# EAGLE design LED-Lampe Power  ZXLD1374 (EAGLE 6.5.0)
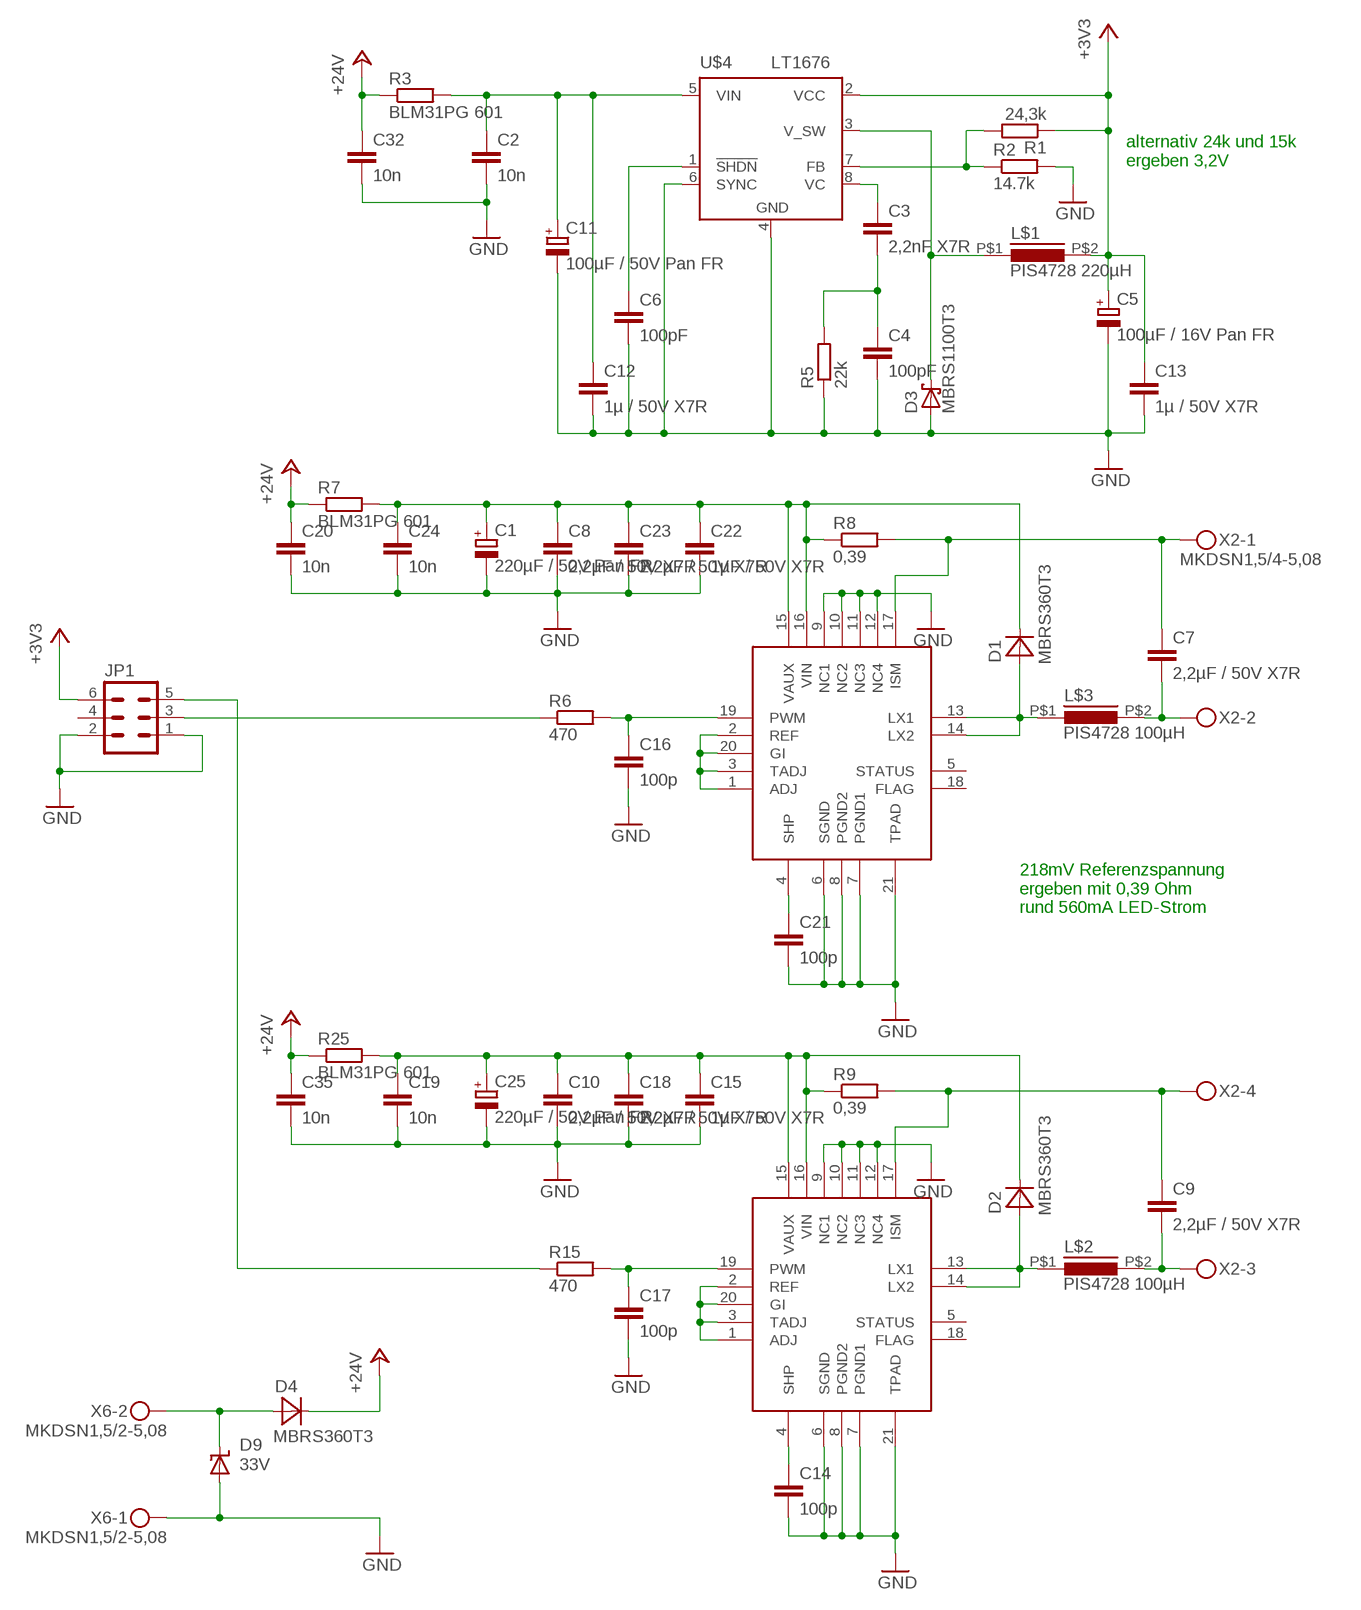
[diagram p0: schematic, sheet 1]

## Parts
C1  220µF / 50V Pan FR  CPOL-EUE5-10.5  [E5-10,5]
C2  10n  C-EUC0805  [C0805]
C3  2,2nF X7R  C-EUC0603  [C0603]
C4  100pF  C-EUC0603  [C0603]
C5  100µF / 16V Pan FR  CPOL-EUE2-5  [E2-5]
C6  100pF  C-EUC0603  [C0603]
C7  2,2µF / 50V X7R  C-EUC1206  [C1206]
C8  2,2µF / 50V X7R  C-EUC1206  [C1206]
C9  2,2µF / 50V X7R  C-EUC1206  [C1206]
C10  2,2µF / 50V X7R  C-EUC1206  [C1206]
C11  100µF / 50V Pan FR  CPOL-EUE3.5-8  [E3,5-8]
C12  1µ / 50V X7R  C-EUC1206  [C1206]
C13  1µ / 50V X7R  C-EUC1206  [C1206]
C14  100p  C-EUC0603  [C0603]
C15  1µF / 50V X7R  C-EUC1206  [C1206]
C16  100p  C-EUC0603  [C0603]
C17  100p  C-EUC0603  [C0603]
C18  2,2µF / 50V X7R  C-EUC1206  [C1206]
C19  10n  C-EUC0805  [C0805]
C20  10n  C-EUC0805  [C0805]
C21  100p  C-EUC0603  [C0603]
C22  1µF / 50V X7R  C-EUC1206  [C1206]
C23  2,2µF / 50V X7R  C-EUC1206  [C1206]
C24  10n  C-EUC0805  [C0805]
C25  220µF / 50V Pan FR  CPOL-EUE5-10.5  [E5-10,5]
C32  10n  C-EUC0805  [C0805]
C35  10n  C-EUC0805  [C0805]
D1  MBRS360T3  [SMC]
D2  MBRS360T3  [SMC]
D3  MBRS1100T3  SCHOTTKY-DIODESMD  [SMB]
D4  MBRS360T3  [SMC]
D9  33V  SUPPRESSOR-SMBJ  [SMBJ]
JP1  ML6  [ML6]
L$1  PIS4728 220µH  FASTON_PIS4728  [FASTON_PIS4728]
L$2  PIS4728 100µH  FASTON_PIS4728  [FASTON_PIS4728]
L$3  PIS4728 100µH  FASTON_PIS4728  [FASTON_PIS4728]
R1  24,3k  R-EU_R1206  [R1206]
R2  14.7k  R-EU_R1206  [R1206]
R3  BLM31PG 601  R-EU_R1206  [R1206]
R5  22k  R-EU_R1206  [R1206]
R6  470  R-EU_R0805  [R0805]
R7  BLM31PG 601  R-EU_R1206  [R1206]
R8  0,39  R-EU_R1206  [R1206]
R9  0,39  R-EU_R1206  [R1206]
R15  470  R-EU_R0805  [R0805]
R25  BLM31PG 601  R-EU_R1206  [R1206]
U$4  LT1676  [S8]
U$5  ZXLD1374  [TSSOP20]
U$6  ZXLD1374  [TSSOP20]
X2  MKDSN1,5/4-5,08  [MKDSN1,5/4-5,08]
X6  MKDSN1,5/2-5,08  [MKDSN1,5/2-5,08]

## Nets
+3V3: C5.+ C13.1 JP1.6 L$1.P$2 R1.1 U$4.2(VCC)
+24V: C20.1 C32.1 C35.1 D4.C R3.1 R7.1 R25.1
GND: C1.- C2.2 C4.2 C5.- C6.2 C8.2 C10.2 C11.- C12.2 C13.2 C14.2 C15.2 C16.2 C17.2 C18.2 C19.2 C20.2 C21.2 C22.2 C23.2 C24.2 C25.- C32.2 C35.2 D3.A D9.A JP1.1 JP1.2 R2.2 R5.1 U$4.4(GND) U$4.6(SYNC) U$5.6(SGND) U$5.7(PGND1) U$5.8(PGND2) U$5.9(NC1) U$5.10(NC2) U$5.11(NC3) U$5.12(NC4) U$5.21(TPAD) U$6.6(SGND) U$6.7(PGND1) U$6.8(PGND2) U$6.9(NC1) U$6.10(NC2) U$6.11(NC3) U$6.12(NC4) U$6.21(TPAD) X6.1
N$1: C2.1 C11.+ C12.1 R3.2 U$4.5(VIN)
N$2: U$5.1(ADJ) U$5.2(REF) U$5.3(TADJ) U$5.20(GI)
N$3: C3.2 C4.1 R5.2
N$4: R1.2 R2.1 U$4.7(FB)
N$5: D3.C L$1.P$1 U$4.3(V_SW)
N$6: JP1.3 R6.1
N$7: C1.+ C8.1 C22.1 C23.1 C24.1 D1.C R7.2 R8.1 U$6.15(VAUX) U$6.16(VIN)
N$9: D4.A D9.C X6.2
N$11: C3.1 U$4.8(VC)
N$12: C9.2 L$2.P$2 X2.3
N$13: C17.1 R15.2 U$5.19(PWM)
N$14: C6.1 U$4.1(!SHDN)
N$15: C9.1 R9.2 U$5.17(ISM) X2.4
N$16: C14.1 U$5.4(SHP)
N$17: D2.A L$2.P$1 U$5.13(LX1) U$5.14(LX2)
N$18: C16.1 R6.2 U$6.19(PWM)
N$19: C7.2 L$3.P$2 X2.2
N$20: C7.1 R8.2 U$6.17(ISM) X2.1
N$21: U$6.1(ADJ) U$6.2(REF) U$6.3(TADJ) U$6.20(GI)
N$22: C21.1 U$6.4(SHP)
N$23: D1.A L$3.P$1 U$6.13(LX1) U$6.14(LX2)
N$48: C10.1 C15.1 C18.1 C19.1 C25.+ D2.C R9.1 R25.2 U$5.15(VAUX) U$5.16(VIN)
P1.6: JP1.5 R15.1
Unconnected: JP1.4 U$5.5(STATUS) U$5.18(FLAG) U$6.5(STATUS) U$6.18(FLAG)

## Notes on the sheet
- alternativ 24k und 15k
  ergeben 3,2V
- 218mV Referenzspannung
  ergeben mit 0,39 Ohm 
  rund 560mA LED-Strom

## Library data of the parts
C1 C5 C11 C25 = rcl:CPOL-EU: POLARIZED CAPACITOR, European symbol
C2-C4 C6 C14 C16 C17 C19-C21 C24 C32 C35 = rcl:C-EU: CAPACITOR, European symbol
C7-C10 C12 C13 C15 C18 C22 C23 = resistor:C-EU: CAPACITOR, European symbol
D1 D2 D4 = diode:MBRS360T3: Surface Mount Schottky Power Rectifier Source: http://www.onsemi.com/pub_link/Collateral/MBRA340T3-D.PDF
D3 = diode:SCHOTTKY-DIODE: Schottky Diode
D9 = diode:SUPPRESSOR-: Suppressor diode
JP1 = con-harting-ml:ML6: HARTING; OC_FARNELL: unknown; OC_NEWARK: unknown
L$1-L$3 = LED-Treiber:FASTON_PIS4728: Schaltregler Induktivität
R1-R3 R5-R9 R15 R25 = rcl:R-EU_: RESISTOR, European symbol
U$4 = LT1676:LT1676: Wide Input Range, High Efficiency, Step-Down Switching Regulator Wide Input Range: 7.4V to 60V 700mA Peak Switch Current Rating Adaptive Switch Drive Maintains Efficiency at High Load Without Pulse Skipping at Light Load True Current Mode Control 100kHz Fixed Operating Frequency
U$5 U$6 = ZXLD:ZXLD1374
X2 = con-phoenix-508:MKDSN1,5/4-5,08: MKDSN 1,5/ 4-5,08 Printklemme Nennstrom: 13,5 A Nennspannung: 250 V Rastermaß: 5,08 mm Polzahl: 4 Anschlussart: Schraubanschluss Montage: Löten Anschlussrichtung Leiter/Platine: 0 ° Artikelnummer: 1729144 Source: http://eshop.phoenixcontact.com .. 1729144.pdf; MPN: SMKDSN1,5/4-5,08; OC_FARNELL: 1792905; OC_NEWARK: 70R0300
X6 = con-phoenix-508:MKDSN1,5/2-5,08: MKDSN 1,5/ 2-5,08 Printklemme Nennstrom: 13,5 A Nennspannung: 250 V Rastermaß: 5,08 mm Polzahl: 2 Anschlussart: Schraubanschluss Montage: Löten Anschlussrichtung Leiter/Platine: 0 ° Artikelnummer: 1729128 Source: http://eshop.phoenixcontact.com .. 1729128.pdf; MPN: MKDSN 1,5/2-5.08; OC_FARNELL: 1792903; OC_NEWARK: 30M2397

## Net classes
0 default: clearance 0.203 mm

## Board
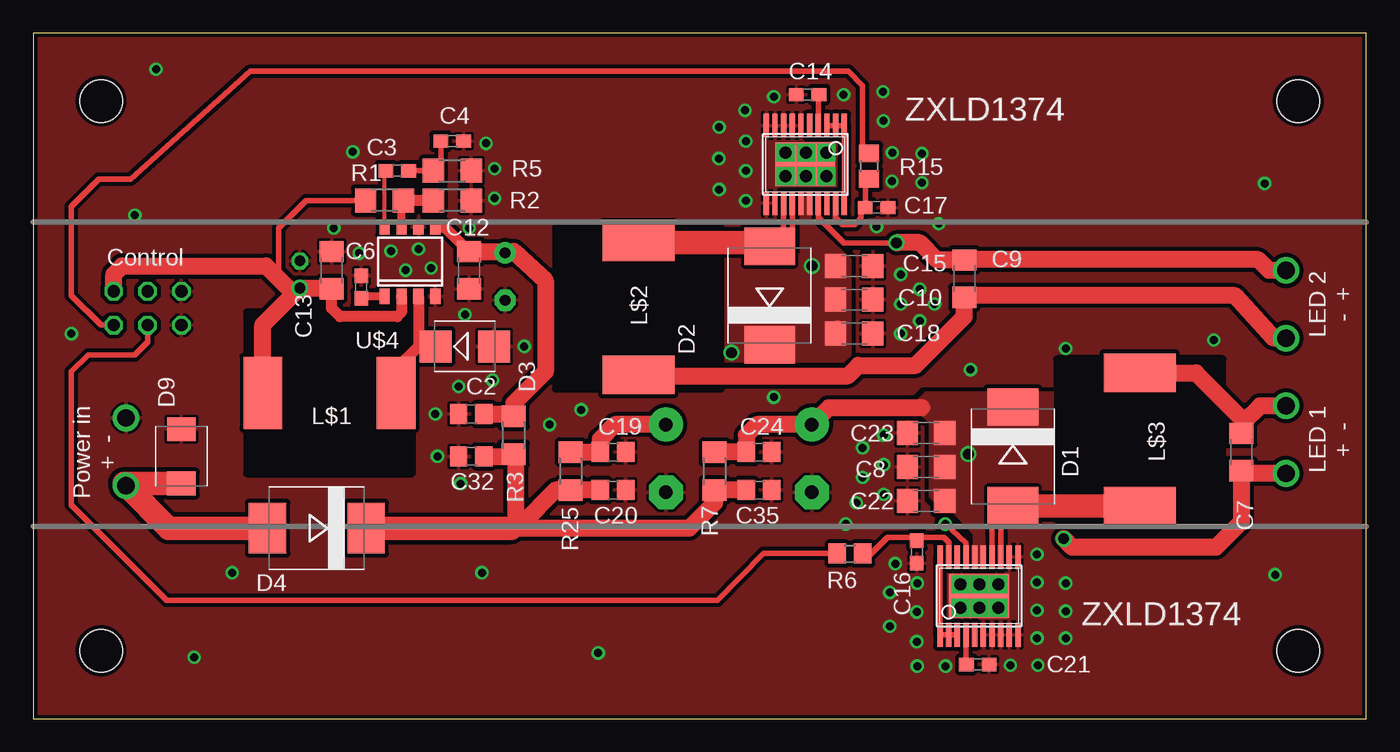
[diagram p1: board, top side]
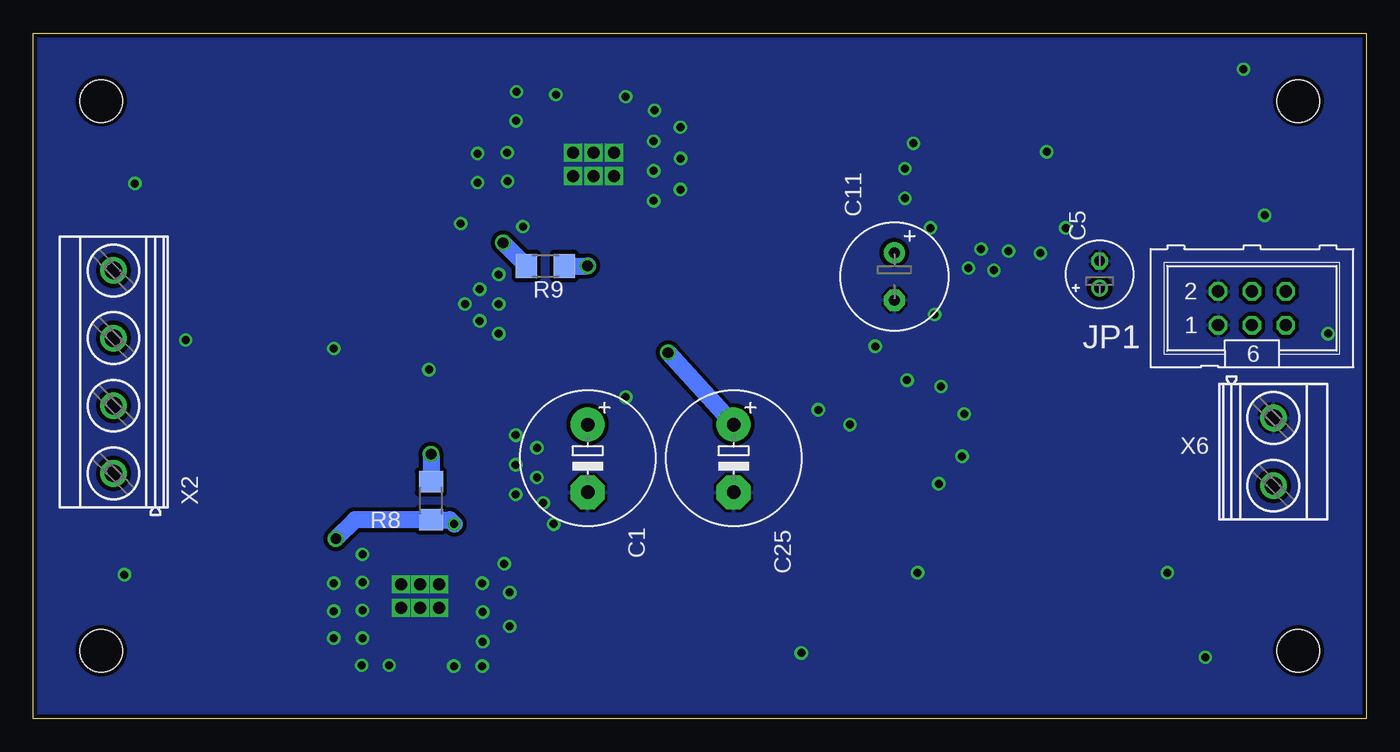
[diagram p2: board, bottom side, seen from below]

Size 100.01 x 51.44 mm. Coordinates in mm from the lower left corner, seen from the top.
Outline: 0,0 100,0 100,51.1 100.01,51.37 100.01,51.44 0,51.44 0,0
Copper layers (1*16): Top 0.018mm / dielectric 1.55mm / Bottom 0.018mm
Design rules "eC_2Layer_PClass6_BaseCopperO18_eCDefault mod": minimum track width 0.15mm, minimum drill 0.35mm, track to track 0.15mm, track to pad 0.15mm, pad to pad 0.15mm, via to via 0.15mm, smd to smd 0mil, copper to edge 0.25mm, drill to drill 0.35mm, minimum pad ring 0.175mm, minimum via ring 0.2mm, stop-mask expansion 0mil, vias tented up to drill 0.45mm, thermal gap 0.2mm
Holes 3.2 mm at 5.08,46.35 5.08,5.08 94.92,5.08 94.92,46.35
tRestrict: area 76.8,14.9 to 89.2,27; area 39.2,24.8 to 51.6,36.8; area 16,18.4 to 28.4,30.5

### Footprints (pad centres in the part's own frame; a part is rotated, then mirrored left to right if it is on the bottom)
E5-10,5 = drill 1.016 pad 2.54: + -2.54,0 | drill 1.016 pad 2.54 octagon: - 2.54,0
C0805 = smd 1.3 x 1.5: 1 -0.95,0; 2 0.95,0
C0603 = smd 1.1 x 1: 1 -0.85,0; 2 0.85,0
E2-5 = drill 0.813 pad 1.27: + -1.016,0 | drill 0.813 pad 1.27 octagon: - 1.016,0
C1206 = smd 1.6 x 1.8: 1 -1.4,0; 2 1.4,0
E3,5-8 = drill 0.813 pad 1.6: + -1.778,0 | drill 0.813 pad 1.6 octagon: - 1.778,0
SMC = smd 2.8 x 3.8: A 3.7,0; C -3.7,0
SMB = smd 2.4 x 2.4: A 2.2,0; C -2.2,0
SMBJ = smd 1.78 x 2.16: A 2.04,0; C -2.03,0
ML6 = drill 0.914 octagon: 1 -2.54,-1.27; 2 -2.54,1.27; 3 0,-1.27; 4 0,1.27; 5 2.54,-1.27; 6 2.54,1.27
FASTON_PIS4728 = smd 5.4 x 2.9: P$1 0,5; P$2 0,-5
R1206 = smd 1.6 x 1.803: 1 -1.422,0; 2 1.422,0
R0805 = smd 1.3 x 1.5: 1 -0.95,0; 2 0.95,0
S8 = smd 0.762 x 1.143: 1 -1.905,-2.6; 2 -0.635,-2.6; 3 0.635,-2.6; 4 1.905,-2.6; 5 1.905,2.6; 6 0.635,2.6; 7 -0.635,2.6; 8 -1.905,2.6
TSSOP20 = smd 0.406 x 1.778: 1 -2.925,-2.918; 2 -2.275,-2.918; 3 -1.625,-2.918; 4 -0.975,-2.918; 5 -0.325,-2.918; 6 0.325,-2.918; 7 0.975,-2.918; 8 1.625,-2.918; 9 2.275,-2.918; 10 2.925,-2.918; 11 2.925,2.918; 12 2.275,2.918; 13 1.625,2.918; 14 0.975,2.918; 15 0.325,2.918; 16 -0.325,2.918; 17 -0.975,2.918; 18 -1.625,2.918; 19 -2.275,2.918; 20 -2.925,2.918 | smd 4.49 x 3.29: 21 0,0
MKDSN1,5/4-5,08 = drill 1.3 pad 2: 1 -7.641,0.025; 2 -2.561,0.025; 3 2.519,0.025; 4 7.599,0.025
MKDSN1,5/2-5,08 = drill 1.3 pad 2: 1 -2.561,0.025; 2 2.519,0.025

### Placement (x,y rotation side)
C1  58.42,19.53 270 bottom
C2  32.86,22.86 180 top
C3  27.3,41.12 0 top
C4  31.43,43.34 0 top
C5  20,33.34 90 bottom
C6  24.61,32.38 90 top
C7  90.65,20 90 top
C8  66.99,18.89 180 top
C9  69.85,33.02 270 top
C10  61.59,31.43 0 top
C11  35.4,33.18 270 bottom
C12  32.7,33.66 270 top
C13  22.38,33.66 90 top
C14  58.1,46.83 180 top
C15  61.59,33.97 0 top
C16  66.29,12.51 270 top
C17  63.28,38.35 0 top
C18  61.59,28.89 0 top
C19  43.5,20 0 top
C20  43.5,17.14 0 top
C21  70.87,4.06 0 top
C22  66.99,16.35 180 top
C23  66.99,21.43 180 top
C24  54.45,20 0 top
C25  47.47,19.53 270 bottom
C32  32.86,19.68 180 top
C35  54.45,17.14 0 top
D1  73.5,19.68 270 top
D2  55.24,31.75 90 top
D3  32.38,27.94 0 top
D4  21.27,14.29 180 top
D9  11.11,19.68 90 top
JP1  8.57,30.8 0 bottom
L$1  22.23,24.45 270 top
L$2  45.4,30.8 0 top
L$3  83.03,20.95 180 top
R1  26.35,38.89 0 top
R2  31.43,38.89 0 top
R3  36.04,21.27 90 top
R5  31.43,41.12 180 top
R6  61.28,12.38 0 top
R7  51.12,18.57 90 top
R8  70.17,16.35 270 bottom
R9  61.59,33.97 180 bottom
R15  62.71,41.47 270 top
R25  40.32,18.57 90 top
U$4  28.26,34.29 0 top
U$5  57.92,41.59 180 top
U$6  70.96,9.21 0 top
X2  93.98,26.04 90 bottom
X6  6.99,20 270 bottom

### Tracks (layer width: path | path; a pad name or v marks a point on that pad's centre or on a via)
+3V3
  Top 0.406: R1.1 20.48,38.89 18.41,36.83 18.41,33.02
  Top 0.813: U$4.2 27.62,30.48 27.3,30.16 23.02,30.16 22.38,30.8 C13.1
  Top 1.016: C5.+ 19.11,32.32 19.05,32.38
  Top 1.27: L$1.P$2 17.23,29.54 C5.+ 22.32,32.32 C13.1 | JP1.6 6.03,33.34 6.67,33.97 17.46,33.97 18.41,33.02 19.05,32.38
+24V
  Top 1.016: 36.19,19.68 R3.1 | 36.05,14.42 36.66,14.62 36.52,14.29 | 36.05,14.42 35.85,14.29 | R7.1 | R25.1 | 36.19,14.56 36.05,14.42
  Top 1.27: C32.1 36.19,19.68 36.19,14.56 | C35.1 R7.1 | C20.1 R25.1 39.19,17.14 36.66,14.62 | R7.1 51.12,16.19 49.21,14.29 36.52,14.29
  Top 1.778: D4.C 35.85,14.29
GND  (via drill 0.6, 0.9)
  other vias: 32.38,30.32 32.7,36.83 34.61,39.05 34.61,41.27 26.83,35.08 28.89,35.24 29.84,33.81 27.94,33.66 31.91,24.92 30.32,19.68 30.16,22.86 32.07,17.62 36.83,27.94 34.45,25.4 23.97,42.55 33.97,43.18 22.54,36.83 65.09,31.11 67.94,37.15 64.42,40.32 65.09,33.34 55.56,24.13 53.47,38.86 63.75,47.05 66.67,40.23 77.47,27.78 53.47,43.34 51.47,39.72 65.09,28.89 61.75,16.19 62.23,20.32 63.28,36.93 63.79,44.86 60.96,14.61 63.82,16.83 63.82,21.27 77.47,8.06 77.47,6.03 75.31,8.13 77.47,10.16 75.31,6.03 64.26,9.46 75.31,12.32 75.31,10.22 64.67,11.62 66.33,10.16 73.31,4 66.67,42.42 66.29,5.78 66.29,8 64.26,6.92 66.33,3.94 63.82,19.05 62.23,18.1 66.52,32.23 66.52,29.84 33.66,10.95 24.45,34.92 67.63,31.11 9.21,48.74 12.06,4.6 55.56,46.67 60.8,46.83 92.39,40.16 93.19,10.79 14.92,10.95 42.39,4.92 70.33,26.19 88.58,28.42 2.86,28.89 7.62,37.78 51.44,42.04 64.45,42.48 53.4,45.66 75.37,4 68.45,3.94 41.12,23.18 38.73,22.07 53.47,41.12 51.47,44.39 56.45,42.48 59.5,42.48 59.5,40.7 57.98,40.7 56.45,40.7 57.98,42.48 69.56,10.06 70.99,10.06 72.42,10.06 69.56,8.32 70.99,8.32 72.42,8.32
  pour Top (isolate 0.305, rank 2): 0,51.44 100,51.44 100,0 0,0
  pour Bottom (isolate 0.305): 0,0 100,0 100,51.44 0,51.44
N$1
  Top 0.813: U$4.5 30.87,36.89 C12.1
  Top 1.016: 36.19,22.86 R3.2 | C11.+ 35.14,34.96 35.24,35.05
  Top 1.27: C12.1 35.24,35.05 36.06,35.05 38.42,32.86 38.42,26.04 36.04,23.65 R3.2 | C2.1 36.19,22.86
N$2
  Top 0.406: U$5.3 U$5.2 U$5.1 U$5.20
N$3
  Top 0.406: C3.2 R5.2 30.58,41.53 C4.1
  Top 0.813: 30.35,41.61 R5.2
N$4
  Top 0.61: U$4.7 27.62,38.1 27.62,38.73 R1.2
  Top 0.813: R2.1 R1.2
N$5
  Top 0.813: U$4.3 28.89,27.94 | L$1.P$1 27.23,26.27 28.89,27.94 | 28.89,27.94 D3.C
N$6
  Top 0.406: R6.1 54.8,12.38 51.34,8.89 10,8.89 2.86,16.03 2.86,26.04 4.13,27.3 7.62,27.3 8.57,28.26 JP1.3
N$7  (via drill 0.8)
  Top 1.016: 72.07,23.5 72.07,23.39 D1.C | C24.1 | R7.2
  Top 1.27: 66.67,23.34 59.69,23.34 C1.+ 54.29,22.07 53.5,21.27 C24.1 | C24.1 R7.2
  Bottom 0.254: v70.17,19.84
  Bottom 1.27: v70.17,19.84 R8.1
  pour Top (isolate 0.254, no thermals): 71.37,11.37 71.25,16.19 76.83,16.19 76.83,24.45 66.99,24.45 65.88,23.34 66.36,23.18 67.31,22.23 67.31,16.67 67.94,16.03 68.58,16.03 70.61,13.87 70.61,11.37
N$9
  Top 1.27: 6.81,17.66 X6.2
  Top 1.778: D9.C 6.81,17.66 | D4.A 10.16,14.29 X6.2
N$11
  Top 0.305: U$4.8 26.35,41.15 C3.1
N$12
  Top 1.016: 45.8,25.72 L$2.P$2 | 69.98,31.75 C9.2 | 93.98,28.57 X2.3
  Top 1.27: 45.8,25.72 61.12,25.72 61.91,26.51 66.2,26.51 69.85,30.16 C9.2 | 69.98,31.75 90.17,31.75 93.03,28.57 93.98,28.57
N$13
  Top 0.406: U$5.19 60.2,37.59 60.71,37.08 61.63,37.08 62.1,37.59 62.1,38.35 C17.1 62.43,40.4 R15.2
N$14
  Top 0.61: U$4.1 24.7,31.69 C6.1
N$15  (via drill 0.8)
  Top 0.406: U$5.17 58.9,37.62 60.83,35.69 64.74,35.69 v64.77,35.72
  Top 1.016: 70.2,34.45 C9.1
  Top 1.27: C9.1 67.81,34.42 66.52,35.72 v64.77,35.72 | X2.4 92.73,33.63 91.92,34.45 70.2,34.45
  Bottom 1.016: v64.76,35.73 v64.77,35.72
  Bottom 1.27: R9.2 v64.76,35.73
N$16
  Top 0.406: U$5.4 58.9,46.78 C14.1
N$17
  Top 0.406: U$5.13 56.3,35.79 | 56.3,35.79 55.93,35.42 | U$5.14 56.95,36.44 56.3,35.79
  Top 0.61: 55.93,35.42 D2.A
  Top 1.016: L$2.P$1 45.48,35.8 45.24,35.72 | 54.34,35.72 D2.A
  Top 1.778: 45.24,35.72 54.34,35.72
N$18
  Top 0.406: R6.2 62.55,12.06 64.07,13.59 66.29,13.59 | U$6.19 68.69,13.23 68.33,13.59 66.29,13.59 | C16.1 66.17,13.21 66.29,13.59
N$19
  Top 1.016: 90.65,22.54 90.65,21.88 90.81,22.23
  Top 1.27: L$3.P$2 87.23,25.95 90.65,22.54 | C7.2 90.81,22.23 92.05,23.47 X2.2
N$20  (via drill 0.6, 0.8)
  Top 0.406: U$6.17 69.99,13.2 v68.42,14.61
  Top 1.016: X2.1 93.8,18.39 | 90.62,18.41 C7.1
  Top 1.27: C7.1 90.65,14.76 88.74,12.86 77.95,12.86 v77.31,13.49 | 93.8,18.39 93.19,18.41 90.62,18.41
  Bottom 1.27: v77.31,13.49 75.88,14.93 R8.2 68.75,14.93 v68.42,14.61
N$21
  Top 0.406: U$6.3 U$6.2 U$6.1 U$6.20
N$22
  Top 0.406: U$6.4 69.99,4.09 C21.1
N$23
  Top 0.406: U$6.14 71.94,14.9 72.92,15.88 | U$6.13 72.59,15.33 73.19,15.93
  Top 0.61: 72.92,15.88 73.19,15.93 D1.A
  Top 1.016: 73.53,15.96 D1.A
  Top 1.778: L$3.P$1 73.53,15.96
N$48  (via drill 0.8)
  Top 1.016: 55.88,27.41 D2.C | 60.33,29.4 C18.1 | C19.1
  Top 1.27: C25.+ 43.66,22.07 42.55,20.95 C19.1 | R25.2 C19.1
  Bottom 1.016: 52.23,27.47 v52.39,27.46
  Bottom 1.27: R9.1 v58.42,33.97 | v52.39,27.46 C25.+
  pour Top (isolate 0.254, no thermals): 57.63,39.4 57.63,34.8 51.59,34.8 51.59,26.83 60.8,26.83 61.28,27.3 61.28,34.45 58.29,37.27 58.29,39.4
P1.6
  Top 0.406: JP1.5 5.08,29.53 2.86,31.75 2.86,38.42 4.92,40.48 7.3,40.48 16.29,48.58 61.15,48.58 62.23,47.5 62.23,42.48 R15.1

### Text on the board
tNames: Control | LED 2 / - + | LED 1 / + - | Power in / + -